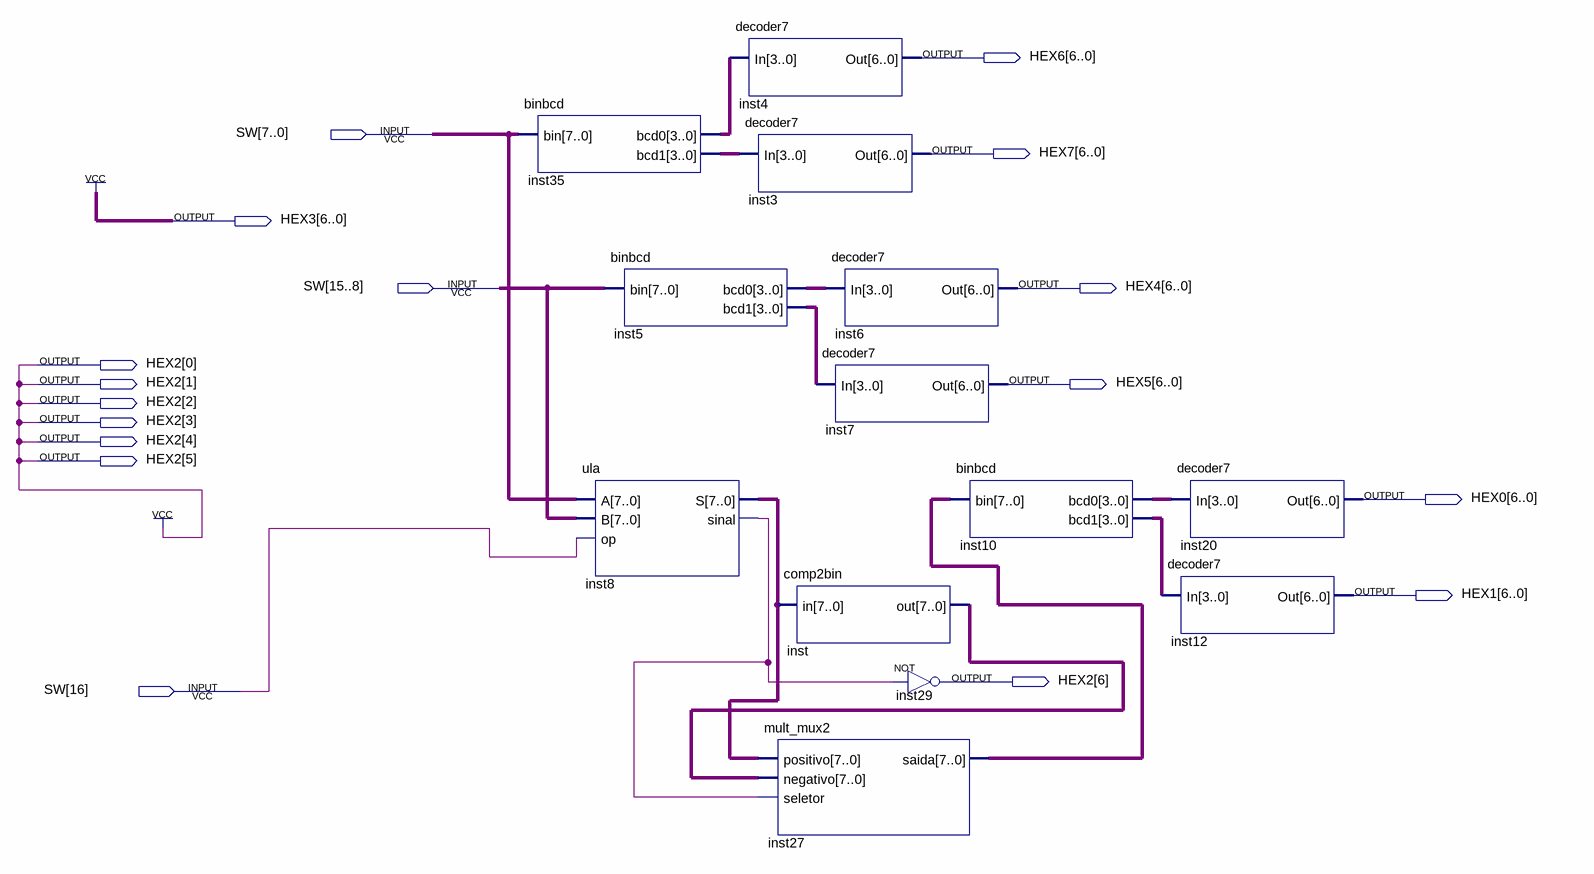
[diagram p0: schematic sheet]
// Quartus schematic testee.bdf as structural Verilog: 13 symbols, 17 pins
module testee (
  input  [16:0] SW,
  output [6:0] HEX6,
  output [6:0] HEX7,
  output [6:0] HEX3,
  output [6:0] HEX4,
  output [6:0] HEX2,
  output [6:0] HEX5,
  output [6:0] HEX0,
  output [6:0] HEX1
);

  wire inst8_sinal;
  wire [3:0] inst5_bcd0, inst5_bcd1, inst10_bcd0, inst10_bcd1, inst35_bcd0, inst35_bcd1;
  wire [7:0] inst8_s, inst27_saida, inst_out;

  binbcd inst35 (.bin(SW[7:0]), .bcd0(inst35_bcd0), .bcd1(inst35_bcd1));
  ula inst8 (.A(SW[7:0]), .B(SW[15:8]), .op(SW[16]), .S(inst8_s), .sinal(inst8_sinal));
  binbcd inst5 (.bin(SW[15:8]), .bcd0(inst5_bcd0), .bcd1(inst5_bcd1));
  decoder7 inst4 (.In(inst35_bcd0), .Out(HEX6));
  decoder7 inst3 (.In(inst35_bcd1), .Out(HEX7));
  comp2bin inst (.in(inst8_s), .out(inst_out));
  mult_mux2 inst27 (.positivo(inst8_s), .negativo(inst_out), .seletor(inst8_sinal), .saida(inst27_saida));
  decoder7 inst6 (.In(inst5_bcd0), .Out(HEX4));
  decoder7 inst7 (.In(inst5_bcd1), .Out(HEX5));
  binbcd inst10 (.bin(inst27_saida), .bcd0(inst10_bcd0), .bcd1(inst10_bcd1));
  not inst29 (HEX2[6], inst8_sinal);
  decoder7 inst20 (.In(inst10_bcd0), .Out(HEX0));
  decoder7 inst12 (.In(inst10_bcd1), .Out(HEX1));

  assign HEX2[5:0] = {6{1'b1}};
  assign HEX3 = {7{1'b1}};
endmodule
